# Altium schematic sheet esp8266.SchDoc
size A4
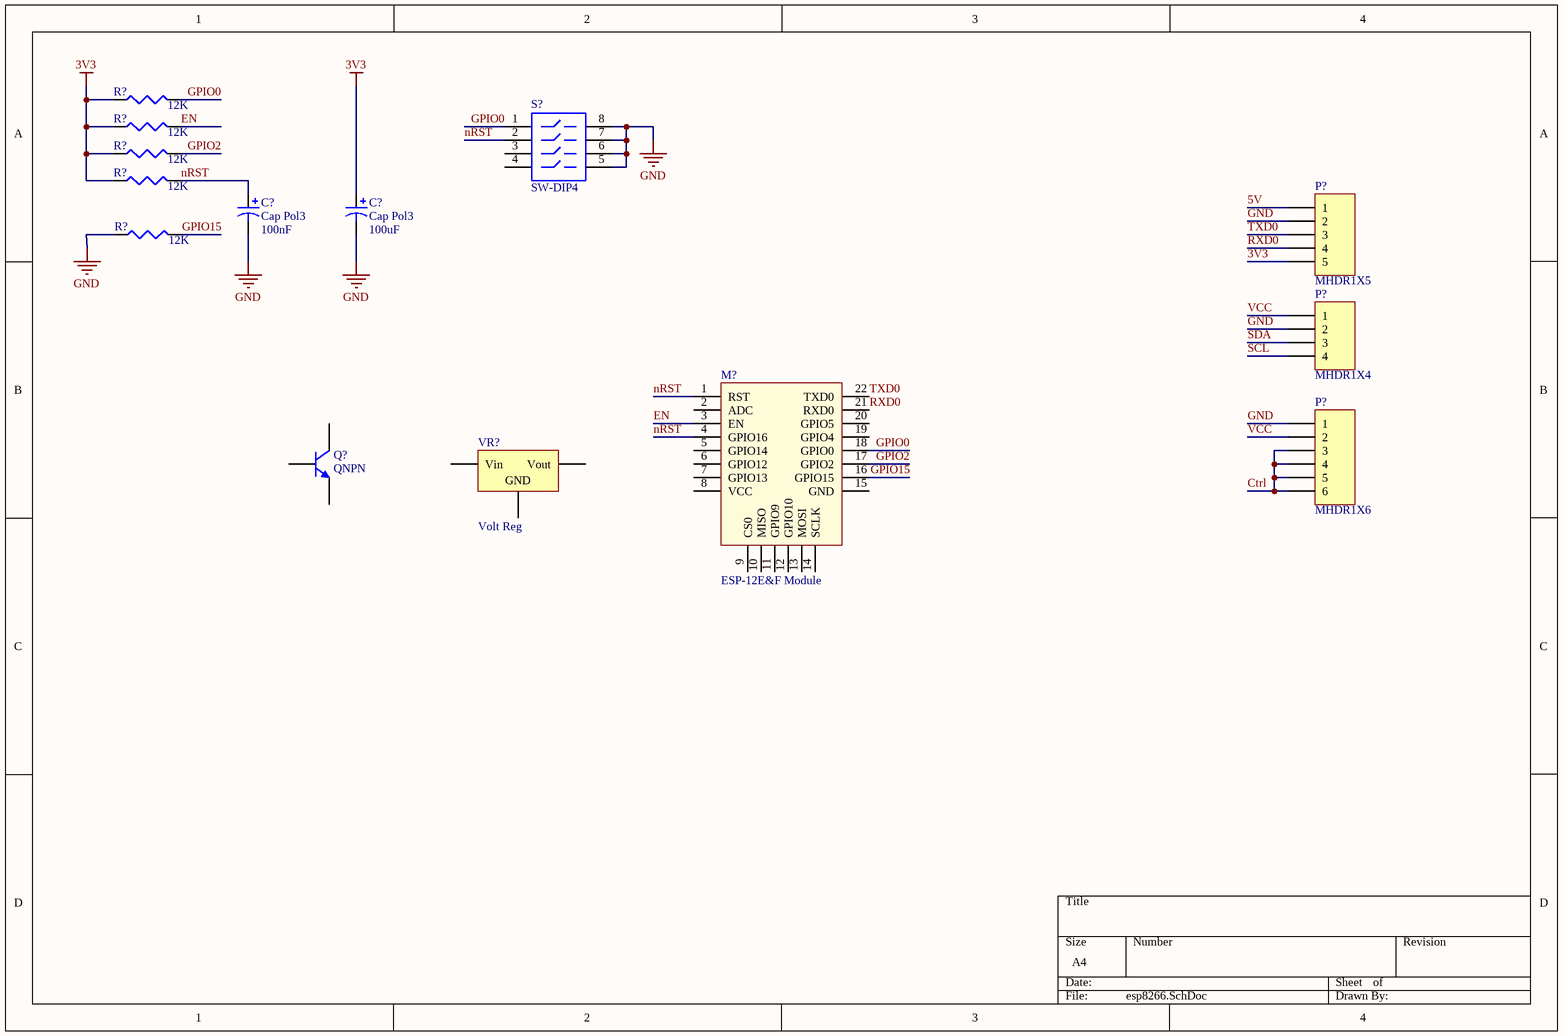
[diagram p0: esp8266.SchDoc]

## Parts
(Parts that share a designator on the sheet are numbered #1, #2 ... from top to bottom, then left to right.)
C?#1  Cap Pol3  value 100nF  [C0805]
C?#2  Cap Pol3  value 100uF  [C0805]
M?  ESP-12E&F Module  [ESP-12E&F Module]
P?#1  MHDR1X5  [MHDR1X5]
P?#2  MHDR1X4  [MHDR1X4]
P?#3  MHDR1X6  [MHDR1X6]
Q?  QNPN  [SOT-23B_N]
R?#1  value 12K  [J1-0603]  (hidden comment: Res3)
R?#2  value 12K  [J1-0603]  (hidden comment: Res3)
R?#3  value 12K  [J1-0603]  (hidden comment: Res3)
R?#4  value 12K  [J1-0603]  (hidden comment: Res3)
R?#5  value 12K  [J1-0603]  (hidden comment: Res3)
S?  SW-DIP4  [DIP-8]
VR?  Volt Reg  [D2PAK_N]

## Nets
3V3: C?#2.1 P?#1.5 R?#1.1 R?#2.1 R?#3.1 R?#4.1
GND: C?#1.2 C?#2.2 P?#1.2 P?#2.2 P?#3.1 R?#5.1 S?.5 S?.6 S?.7 S?.8
5V: P?#1.1
Ctrl: P?#3.3 P?#3.4 P?#3.5 P?#3.6
EN: M?.3(EN) R?#2.2
GPIO0: M?.18(GPIO0) R?#1.2 S?.1
GPIO2: M?.17(GPIO2) R?#3.2
GPIO15: M?.16(GPIO15) R?#5.2
nRST: C?#1.1 M?.1(RST) M?.4(GPIO16) R?#4.2 S?.2
RXD0: M?.21(RXD0) P?#1.4
SCL: P?#2.4
SDA: P?#2.3
TXD0: M?.22(TXD0) P?#1.3
VCC: P?#2.1 P?#3.2

Not connected (* = marked no-connect by the designer): M? 2(ADC) 5(GPIO14) 6(GPIO12) 7(GPIO13) 8(VCC) 9(CS0) 10(MISO) 11(GPIO9) 12(GPIO10) 13(MOSI) 14(SCLK) 15(GND) 19(GPIO4) 20(GPIO5); Q? 1(C) 2(B) 3(E); S? 3 4; VR? 1(Vin) 2(GND) 3(Vout)

## Library data of the parts
C?#1 C?#2 = Cap Pol3: Polarized Capacitor (Surface Mount); Published: 8-Jun-2000; LatestRevisionDate: 29-May-2009; LatestRevisionNote: IPC-7351 Footprint Added.; PackageReference: C0805; Publisher: Altium Limited; PackageDescription: Chip Capacitor
P?#1 = MHDR1X5: Header, 5-Pin; LatestRevisionDate: 17-Jul-2002; LatestRevisionNote: Re-released for DXP Platform.; Publisher: Altium Limited
P?#2 = MHDR1X4: Header, 4-Pin; LatestRevisionDate: 17-Jul-2002; LatestRevisionNote: Re-released for DXP Platform.; Publisher: Altium Limited
P?#3 = MHDR1X6: Header, 6-Pin; LatestRevisionDate: 17-Jul-2002; LatestRevisionNote: Re-released for DXP Platform.; Publisher: Altium Limited
Q? = QNPN: NPN Bipolar Transistor; Published: 8-Jun-2000; LatestRevisionDate: 29-May-2009; LatestRevisionNote: IPC-7351 Footprint Added.; PackageVersion: Aug-1999; PackageReference: SOT-23B; Publisher: Altium Limited; PackageDescription: 3-Pin SOT-23 Package 0.95 mm Pitch, 2.4 mm Lead Span
R?#1-R?#5 = Res3: Resistor; Published: 8-Jun-2000; LatestRevisionDate: 29-May-2009; LatestRevisionNote: IPC-7351 Footprint Added.; PackageReference: J1-0603; Publisher: Altium Limited; PackageDescription: Chip Resistor
S? = SW-DIP4: DIP Switch; Published: 24-Mar-1999; LatestRevisionDate: 17-Jul-2002; LatestRevisionNote: Re-released for DXP Platform.; PackageReference: DIP-8; Publisher: Altium Limited
VR? = Volt Reg: Voltage Regulator; Published: 24-Mar-1999; LatestRevisionDate: 29-May-2009; LatestRevisionNote: IPC-7351 Footprint Added.; PackageReference: D2PAK; Publisher: Altium Limited; PackageDescription: 3-Pin Transistor Outline Package 2.54 mm Pitch, 15.1 mm Lead Span